# Altium project FT8_RP2040_TRX.PrjPcb
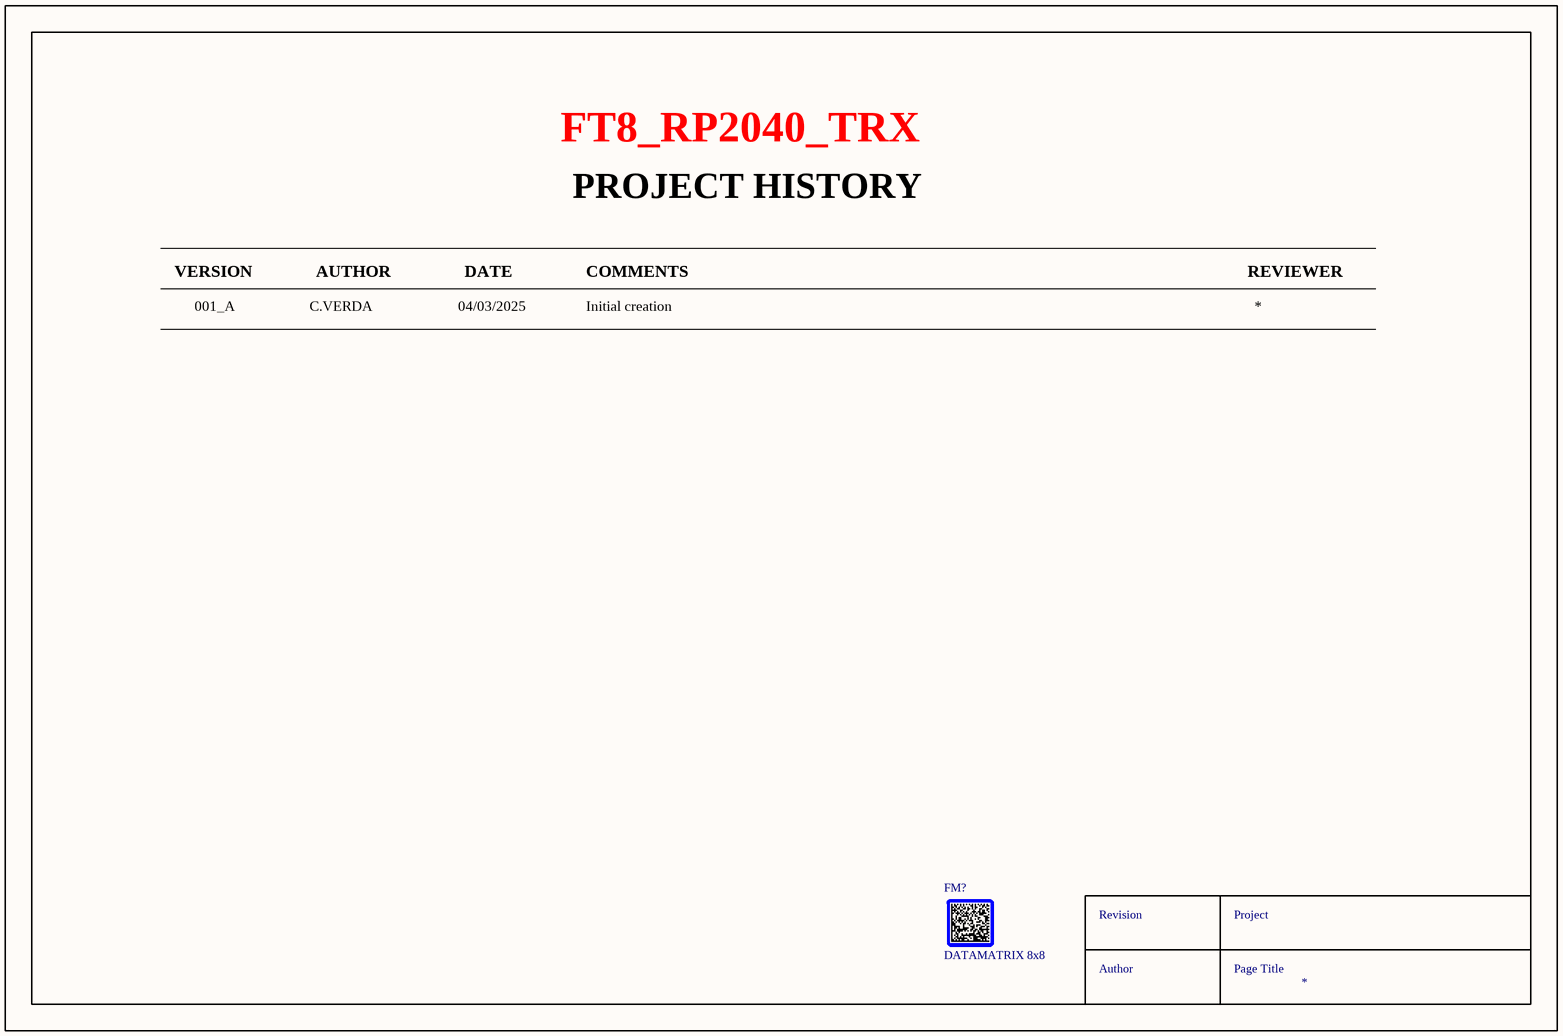
[diagram p0: 00-History.SchDoc]
SCH_REV: A; REVISION_VALUE: 001_A; PROJECT_NAME: FT8_RP2040_TRX; PCB_REV: A; PCB_PART_NUMBER: <PCB PN>; PCB_ENGINEER_APP_DATE: --/--/----; PCB_ENGINEER: - -----; PCB_DWG_NO: <PCB DWG NO>; PCB_DESIGNER_APP_DATE: --/--/----; PCB_DESIGNER: - -----; PCB_CHECKER_APP_DATE: --/--/----; PCB_CHECKER: - -----; PCB_ASSEMBLY_NO: <PCB ASSY NO>; PCB_ANG_TOL: +/-1/2; PCB_3_DEC_TOL: +/-.010; PCB_2_DEC_TOL: +/-.01; DOC_NO_SCH_DWG: <SCH DWG NO>; DOC_NO_FAB_DWG: <FAB DWG NO>; DOC_NO_BOM: <BOM DOC NO>; DOC_NO_ASSY_DWG: <ASSY DWG NO>; CONTRACT_NUMBER: <CONTRACT NO>; CAGE_CODE: ?????; AUTHOR_NAME: C.VERDA
5 sheets, 2 parts. Net scope: global (net labels, ports and power ports of the same name join across sheets).
Board file: 001_FT8_RP2040_TRX.PcbDoc
Sheets:
  00-History.SchDoc
  01-FBD.SchDoc
    U_02-MCU = 02-MCU.SchDoc
    U_04-Receiver = 04-Receiver.SchDoc
    U_03-Transmitter = 03-Transmitter.SchDoc

## Sheet 00-History.SchDoc
size A4; Author: C.VERDA; Organization: ORGANIZATION; Address1: ADDRESS 1; Address2: ADDRESS 2; Address3: ADDRESS 3; Address4: ADDRESS 4; Revision: 001_A; SheetNumber: 1; SheetTotal: 5; Project: FT8_RP2040_TRX; ENG_APP_DATE: --/--/--; DSN_APP_DATE: --/--/--; CHK_APP_DATE: --/--/--

### Parts
FM?  DATAMATRIX 8x8  [DATAMATRIX 8x8]

### Notes on the sheet
- PROJECT HISTORY
- VERSION
- 001_A
- C.VERDA
- AUTHOR
- 04/03/2025
- DATE
- COMMENTS
- Initial creation
- REVIEWER
- *
- Revision
- Project
- Author
- Page Title

### Library data of the parts
FM? = CMP-00030-00003-2: DataMatrix BMS 8x8mm

## Sheet 01-FBD.SchDoc
size A4; Author: C.VERDA; Organization: ORGANIZATION; Address1: ADDRESS 1; Address2: ADDRESS 2; Address3: ADDRESS 3; Address4: ADDRESS 4; Revision: 001_A; SheetNumber: 2; SheetTotal: 5; Project: FT8_RP2040_TRX; ENG_APP_DATE: --/--/--; DSN_APP_DATE: --/--/--; CHK_APP_DATE: --/--/--
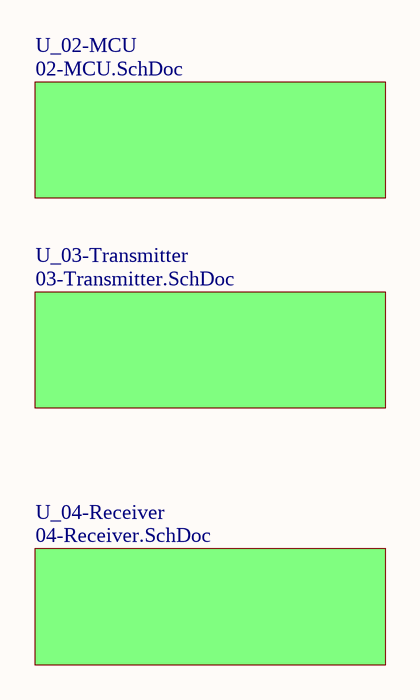
[diagram p1: 01-FBD.SchDoc]

### Sub-sheets
U_02-MCU = 02-MCU.SchDoc: no entries
U_03-Transmitter = 03-Transmitter.SchDoc: no entries
U_04-Receiver = 04-Receiver.SchDoc: no entries

### Notes on the sheet
- Revision
- Project
- Author
- Page Title

## Sheet 02-MCU.SchDoc
size A4; Author: C.VERDA; Organization: ORGANIZATION; Address1: ADDRESS 1; Address2: ADDRESS 2; Address3: ADDRESS 3; Address4: ADDRESS 4; Revision: 001_A; SheetNumber: 3; SheetTotal: 3; Project: FT8_RP2040_TRX; ENG_APP_DATE: --/--/--; DSN_APP_DATE: --/--/--; CHK_APP_DATE: --/--/--

### Notes on the sheet
- Revision
- Project
- Author
- Page Title

## Sheet 04-Receiver.SchDoc
size A4; Author: C.VERDA; Organization: ORGANIZATION; Address1: ADDRESS 1; Address2: ADDRESS 2; Address3: ADDRESS 3; Address4: ADDRESS 4; Revision: 001_A; SheetNumber: 5; SheetTotal: 5; Project: FT8_RP2040_TRX; ENG_APP_DATE: --/--/--; DSN_APP_DATE: --/--/--; CHK_APP_DATE: --/--/--

### Notes on the sheet
- Revision
- Project
- Author
- Page Title

## Sheet 03-Transmitter.SchDoc
size A4; Author: C.VERDA; Organization: ORGANIZATION; Address1: ADDRESS 1; Address2: ADDRESS 2; Address3: ADDRESS 3; Address4: ADDRESS 4; Revision: 001_A; SheetNumber: 4; SheetTotal: 5; Project: FT8_RP2040_TRX; ENG_APP_DATE: --/--/--; DSN_APP_DATE: --/--/--; CHK_APP_DATE: --/--/--
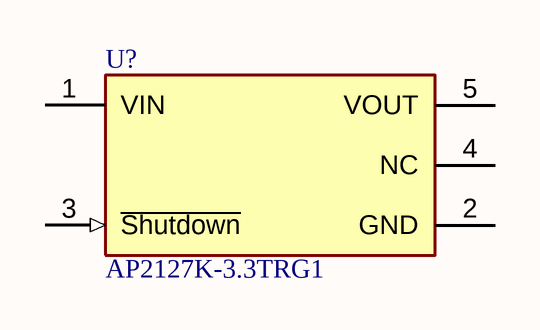
[diagram p2: 03-Transmitter.SchDoc]

### Parts
U?  AP2127K-3.3TRG1  [FP-SOT25-MFG]

### Nets

Not connected (* = marked no-connect by the designer): U? 1(VIN) 2(GND) 3(~{Shutdown}) 4(NC) 5(VOUT)

### Notes on the sheet
- Revision
- Project
- Author
- Page Title

### Library data of the parts
U? = CMP-12756-000001-1: IC REG LINEAR 3.3V 300MA SOT23-5; Manufacturer: Diodes Inc.; Output Type: Fixed; Description: Linear Voltage Regulator IC Positive Fixed 1 Output 300mA SOT-23-5; Max Junction Temp: +150°C; Max Supply Voltage: 6V; Nominal Supply Current: 60uA; Standoff Height: 0.013mm; Min Supply Voltage: 2.5V; Dropout Voltage: 170mV; Number Of Outputs: 1; Accuracy Percentage: 2%; Output Current: 400mA; Temperature Range Low: -40°C; Octopart: https://octopart.com/ap2127k-3.3trg1-diodes+inc.-30954597; Automotive: No; Mouser Description: LDO Voltage Regulators 300mA CMOS LDO 2.5V to 6V; Device Class L3: Voltage Regulators - Linear; Height: 1.4mm; Ambient Temperature Range Low: -40°C; Output Voltage: 3.3V; ComponentLink2Description: Datasheet; RoHS: TRUE; Digikey Description: IC REG LINEAR 3.3V 300MA SOT23-5; Device Class L1: Integrated Circuits (ICs); Device Class L2: Power Management ICs; Footprint Url: https://www.diodes.com/assets/Package-Files/SOT25.pdf; Temperature: -40°C to +85°C; Category: IC; Lead Free: Yes; Temperature Range High: +85°C; Manufacturer Part Number: AP2127K-3.3TRG1; Ambient Temperature Range High: +85°C; Package: SOT25; ComponentLink2URL: https://www.diodes.com/assets/Datasheets/AP2127.pdf